# EAGLE design RPi_SPI_outputs_v02 (EAGLE 7.2.0)
AUTHOR: M.Petrilak; VERSION: 01
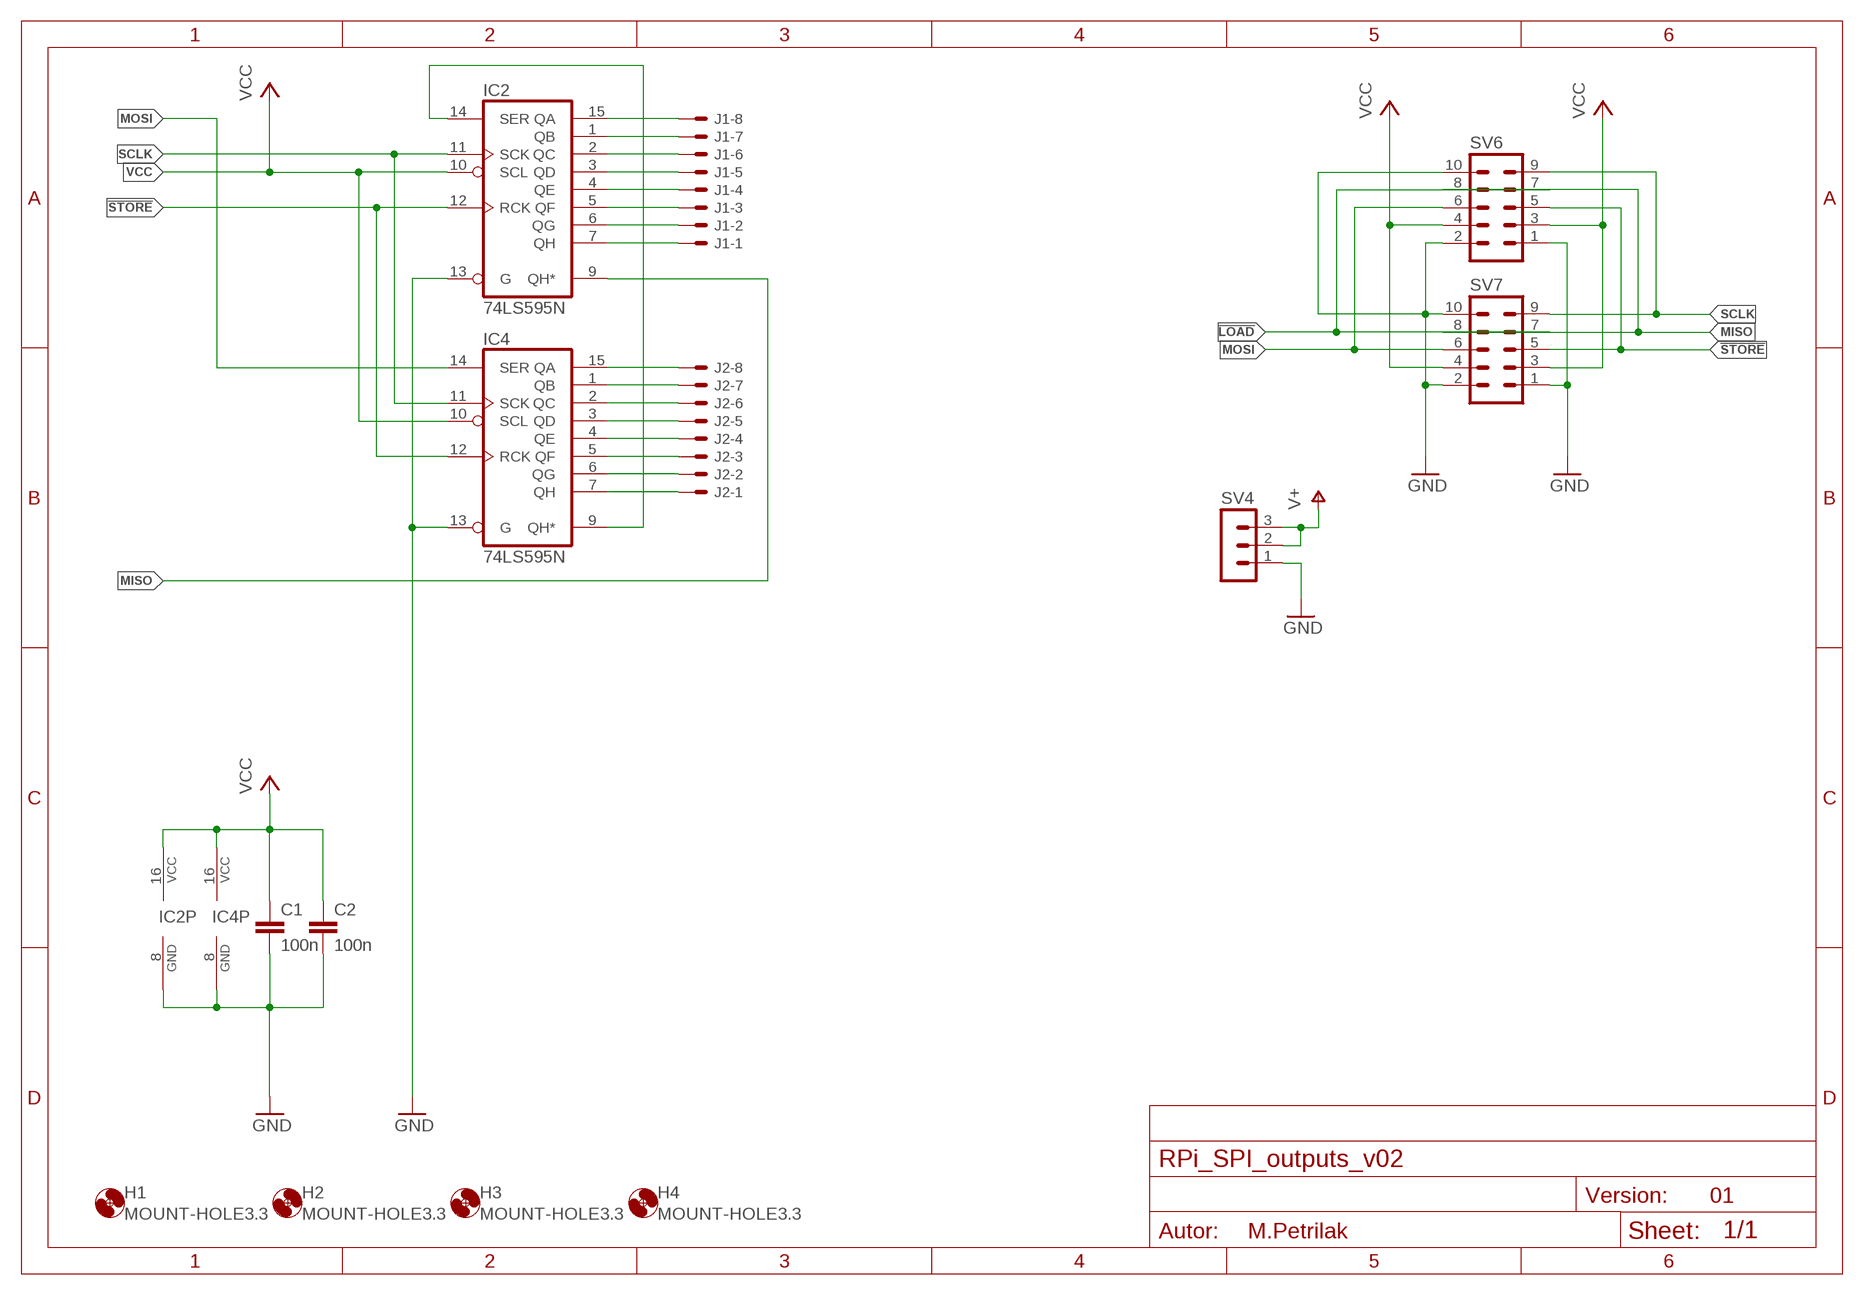
[diagram p0: schematic, sheet 1]

## Parts
C1  100n  C-EUC1206  [C1206]
C2  100n  C-EUC1206  [C1206]
H1  MOUNT-HOLE3.3  [3,3]
H2  MOUNT-HOLE3.3  [3,3]
H3  MOUNT-HOLE3.3  [3,3]
H4  MOUNT-HOLE3.3  [3,3]
IC2  74LS595N  [DIL16]
IC4  74LS595N  [DIL16]
J1  22-05-7088-SPEC-08  [7395-08_SPEC]
J2  22-05-7088-SPEC-08  [7395-08_SPEC]
SV4  MA03-1_NO  [MA03-1_NO]
SV6  ML10  [ML10]
SV7  ML10  [ML10]

## Nets
!LOAD: SV6.7 SV7.7
!STORE: IC2.12(RCK) IC4.12(RCK) SV6.5 SV7.5
GND: C1.2 C2.2 IC2.8(GND) IC2.13(G) IC4.8(GND) IC4.13(G) SV4.1 SV6.1 SV6.2 SV6.10 SV7.1 SV7.2 SV7.10
MISO: IC2.9(QH*) SV6.8 SV7.8
MOSI: IC4.14(SER) SV6.6 SV7.6
N$1: IC2.15(QA) J1.8
N$2: IC2.1(QB) J1.7
N$3: IC2.2(QC) J1.6
N$4: IC2.3(QD) J1.5
N$5: IC2.4(QE) J1.4
N$6: IC2.5(QF) J1.3
N$7: IC2.6(QG) J1.2
N$8: IC2.7(QH) J1.1
N$9: IC4.15(QA) J2.8
N$10: IC4.1(QB) J2.7
N$11: IC4.2(QC) J2.6
N$12: IC4.3(QD) J2.5
N$13: IC4.4(QE) J2.4
N$14: IC4.5(QF) J2.3
N$15: IC4.6(QG) J2.2
N$16: IC4.7(QH) J2.1
N$17: IC2.14(SER) IC4.9(QH*)
SCLK: IC2.11(SCK) IC4.11(SCK) SV6.9 SV7.9
V+: SV4.2 SV4.3
VCC: C1.1 C2.1 IC2.10(SCL) IC2.16(VCC) IC4.10(SCL) IC4.16(VCC) SV6.3 SV6.4 SV7.3 SV7.4

## Library data of the parts
C1 C2 = rcl:C-EU: CAPACITOR, European symbol
H1-H4 = holes:MOUNT-HOLE: MOUNTING HOLE with drill center marker
IC2 IC4 = 74xx-us:74*595: 8-bit SHIFT REGISTER, output latch
J1 J2 = con-molex:22-?-08: CONNECTOR wire to board 2.54 mm (.1 inch) pitch header
SV4 = con-lstb:MA03-1: PIN HEADER
SV6 SV7 = con-harting-ml:ML10: HARTING

## Board
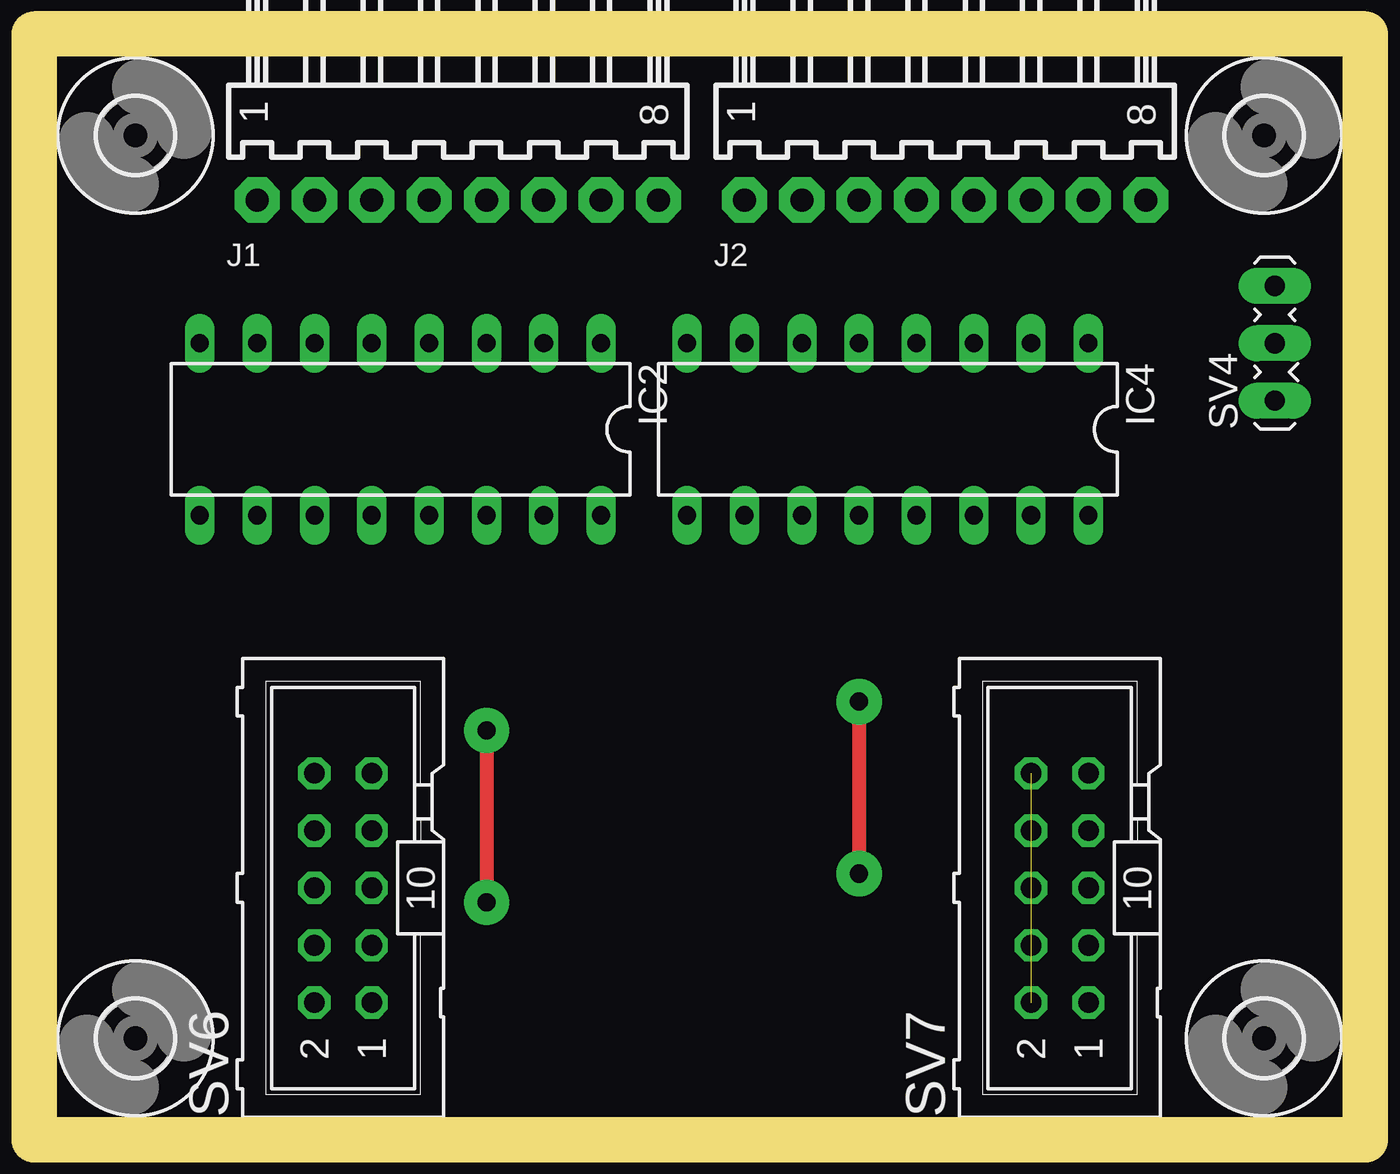
[diagram p1: board, top side]
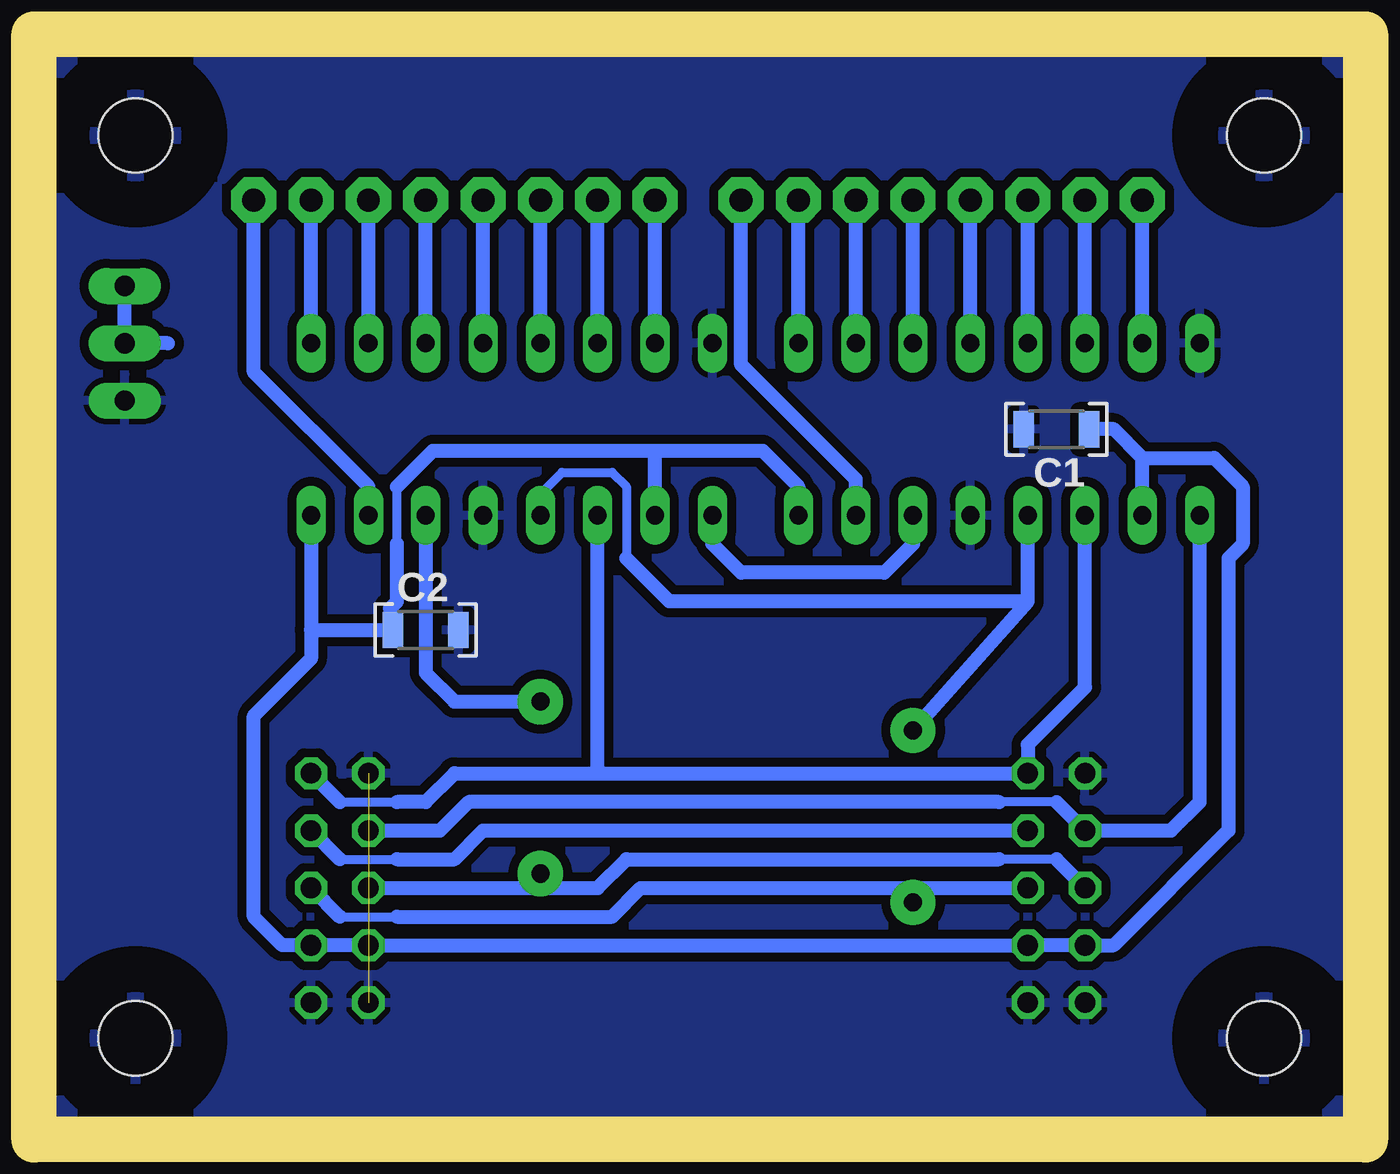
[diagram p2: board, bottom side, seen from below]

Size 57 x 47 mm. Coordinates in mm from the lower left corner, seen from the top.
Outline: 0,0 57,0 57,47 0,47 0,0
Copper layers (1*16): Top 0.035mm / dielectric 1.5mm / Bottom 0.035mm
Design rules "Michal_CNC_doma *": minimum track width 0.3mm, minimum drill 0.6mm, track to track 0.4mm, track to pad 0.4mm, pad to pad 0.4mm, via to via 0.4mm, smd to smd 8mil, copper to edge 1mil, drill to drill 8mil, minimum pad ring 10mil, minimum via ring 8mil, stop-mask expansion 4mil, vias tented up to drill 0mil, thermal gap 10mil
Milling: 4 lines

### Footprints (pad centres in the part's own frame; a part is rotated, then mirrored left to right if it is on the bottom)
C1206 = smd 0.9 x 1.6: 1 -1.45,0; 2 1.45,0
3,3 = hole 3.3: 0,0
DIL16 = drill 0.8 long: 1 -8.89,-3.81; 2 -6.35,-3.81; 3 -3.81,-3.81; 4 -1.27,-3.81; 5 1.27,-3.81; 6 3.81,-3.81; 7 6.35,-3.81; 8 8.89,-3.81; 9 8.89,3.81; 10 6.35,3.81; 11 3.81,3.81; 12 1.27,3.81; 13 -1.27,3.81; 14 -3.81,3.81; 15 -6.35,3.81; 16 -8.89,3.81
7395-08_SPEC = drill 1.016 pad 2 octagon: 1 8.89,0; 2 6.35,0; 3 3.81,0; 4 1.27,0; 5 -1.27,0; 6 -3.81,0; 7 -6.35,0; 8 -8.89,0
MA03-1_NO = drill 0.9 pad 1.6 long: 1 -2.54,0; 2 0,0; 3 2.54,0
ML10 = drill 0.914 octagon: 1 -5.08,-1.27; 2 -5.08,1.27; 3 -2.54,-1.27; 4 -2.54,1.27; 5 0,-1.27; 6 0,1.27; 7 2.54,-1.27; 8 2.54,1.27; 9 5.08,-1.27; 10 5.08,1.27

### Placement (x,y rotation side)
C1  12.7,30.48 180 bottom
C2  40.64,21.59 0 bottom
H1  3.5,3.5 0 top
H2  53.5,3.5 0 top
H3  53.5,43.5 0 top
H4  3.5,43.5 0 top
IC2  15.24,30.48 180 top
IC4  36.83,30.48 180 top
J1  17.78,40.64 180 top
J2  39.37,40.64 180 top
SV4  53.98,34.29 90 top
SV6  12.7,10.16 90 top
SV7  44.45,10.16 90 top

### Tracks (layer width: path | path; a pad name or v marks a point on that pad's centre or on a via)
!LOAD
  Bottom 0.406: 44.45,11.43 41.91,11.43
  Bottom 0.61: SV7.7 44.45,11.43 | SV6.7 38.1,12.7 39.37,11.43 41.91,11.43
!STORE  (via drill 0.8 pad 2)
  Top 0.61: v19.05,17.14 v19.05,9.53
  Bottom 0.406: IC4.12 35.56,27.62 34.61,28.57 32.38,28.57 31.75,27.94 31.75,24.77 | 44.45,8.89 41.91,8.89
  Bottom 0.61: 13.97,22.86 IC2.12 | SV7.5 44.45,8.89 | 19.05,10.16 31.11,10.16 32.38,8.89 41.91,8.89 | 19.05,10.16 SV6.5 | 13.97,22.86 v19.05,17.14 | v19.05,9.53 19.05,10.16 | 13.97,22.86 29.84,22.86 31.75,24.77
GND  (1 unrouted)
  pour Bottom: 0,0 57,0 57,47 0,47
MISO
  Bottom 0.406: 12.7,13.97 15.24,13.97
  Bottom 0.61: SV7.8 40.01,12.7 38.73,13.97 15.24,13.97 | 12.7,13.97 SV6.8 7.62,12.7 6.35,13.97 IC2.9
MOSI  (via drill 0.8 pad 2)
  Top 0.61: v35.56,18.41 v35.56,10.79
  Bottom 0.406: 12.7,11.43 15.24,11.43
  Bottom 0.61: SV7.6 35.56,10.16 | 35.56,10.16 33.02,10.16 31.75,11.43 15.24,11.43 | 12.7,11.43 SV6.6 | IC4.14 40.64,19.68 39.37,18.41 v35.56,18.41 | v35.56,10.79 35.56,10.16
N$1
  Bottom 0.61: IC2.15 21.59,28.26 26.67,33.34 J1.8
N$2
  Bottom 0.61: IC2.1 J1.7
N$3
  Bottom 0.61: IC2.2 J1.6
N$4
  Bottom 0.61: IC2.3 J1.5
N$5
  Bottom 0.61: IC2.4 J1.4
N$6
  Bottom 0.61: IC2.5 J1.3
N$7
  Bottom 0.61: IC2.6 J1.2
N$8
  Bottom 0.61: IC2.7 J1.1
N$9
  Bottom 0.61: IC4.15 43.18,27.94 48.26,33.02 J2.8
N$10
  Bottom 0.61: IC4.1 J2.7
N$11
  Bottom 0.61: IC4.2 J2.6
N$12
  Bottom 0.61: IC4.3 J2.5
N$13
  Bottom 0.61: IC4.4 J2.4
N$14
  Bottom 0.61: IC4.5 J2.3
N$15
  Bottom 0.61: IC4.6 J2.2
N$16
  Bottom 0.61: IC4.7 J2.1
N$17
  Bottom 0.61: IC2.14 19.05,25.4 20.32,24.13 26.67,24.13 27.94,25.4 IC4.9
SCLK
  Bottom 0.406: 44.45,13.97 41.91,13.97
  Bottom 0.61: 33.02,15.24 IC4.11 | SV7.9 44.45,13.97 | 33.02,15.24 39.37,15.24 40.64,13.97 41.91,13.97 | 33.02,15.24 SV6.9 13.97,16.51 11.43,19.05 IC2.11
V+
  Bottom 0.61: 52.07,34.29 SV4.2 SV4.3
VCC
  Bottom 0.406: 41.91,25.4 41.91,27.94
  Bottom 0.61: 30.48,29.53 40.32,29.53 41.91,27.94 | 30.48,29.53 25.72,29.53 24.13,27.94 IC2.16 | IC4.10 30.48,29.53 | IC2.10 8.89,29.21 | 8.89,29.21 10.16,30.48 C1.1 | 8.89,29.21 5.71,29.21 4.45,27.94 4.45,25.4 5.08,24.77 5.08,12.7 10.16,7.62 SV6.4 SV6.3 SV7.4 SV7.3 46.99,7.62 48.26,8.89 48.26,17.78 45.72,20.32 45.72,21.59 | 45.72,21.59 C2.1 42.23,21.73 42.23,22.54 41.91,22.86 41.91,25.4 | IC4.16 45.72,21.59